# Altium schematic sheet FIT_TCM_Power.SchDoc: FIT_PM12 board
size 420 x 297 mm; CheckedBy: G.Kasprowicz; Author: INR Moscow; CompanyName: WUT ISE; DrawnBy: M.Podgórski; Organization: WUT ISE; Address1: PW ISE; Address2: Nowowiejska 15/19 00-665 Warsaw; Address3: gkasprow@gmail.com; Revision: 2; SheetNumber: -; SheetTotal: -; ModifiedBy: -; CheckedDate: -; Title2: Title 2; DivGrp: WUT ISE; Designer: INR RAS; ModifiedDate: -; ProjectName: Sensor Box
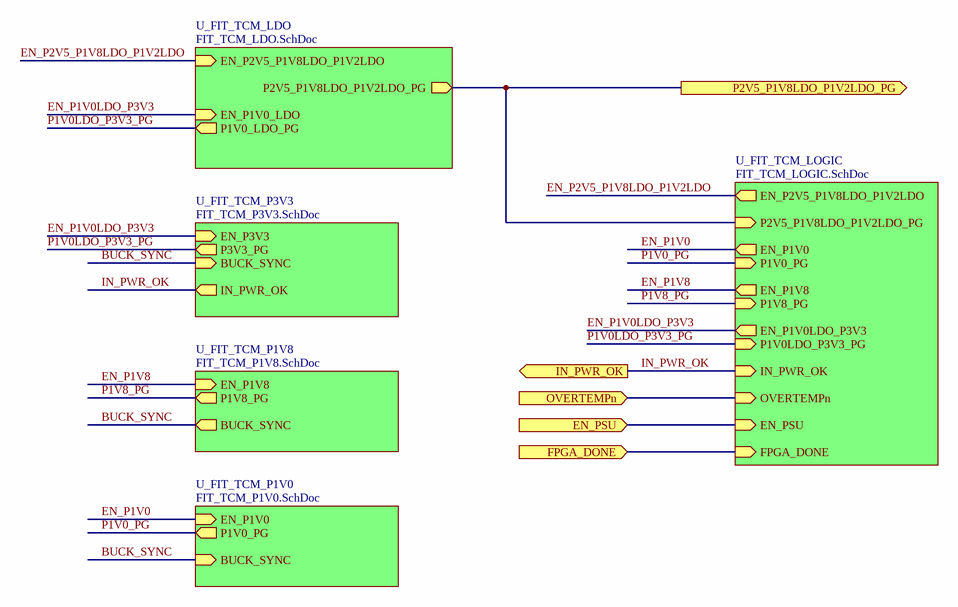
[diagram p0: FIT_TCM_Power.SchDoc]

## Sub-sheets
U_FIT_TCM_LDO = FIT_TCM_LDO.SchDoc: EN_P1V0_LDO (in), P1V0_LDO_PG (out), P2V5_P1V8LDO_P1V2LDO_PG (out), EN_P2V5_P1V8LDO_P1V2LDO (in)
U_FIT_TCM_LOGIC = FIT_TCM_LOGIC.SchDoc: IN_PWR_OK (in), EN_P1V0LDO_P3V3 (out), P1V0LDO_P3V3_PG (in), EN_P1V8 (out), P1V8_PG (in), EN_P1V0 (out), P1V0_PG (in), P2V5_P1V8LDO_P1V2LDO_PG (in), EN_P2V5_P1V8LDO_P1V2LDO (out), EN_PSU (in), OVERTEMPn (in), FPGA_DONE (in)
U_FIT_TCM_P1V0 = FIT_TCM_P1V0.SchDoc: BUCK_SYNC (in), EN_P1V0 (in), P1V0_PG (out)
U_FIT_TCM_P1V8 = FIT_TCM_P1V8.SchDoc: BUCK_SYNC (out), EN_P1V8 (in), P1V8_PG (out)
U_FIT_TCM_P3V3 = FIT_TCM_P3V3.SchDoc: IN_PWR_OK (out), EN_P3V3 (in), BUCK_SYNC (in), P3V3_PG (out)

## Ports
EN_PSU (in), FPGA_DONE (in), IN_PWR_OK (out), OVERTEMPn (in), P2V5_P1V8LDO_P1V2LDO_PG (out)

## Nets
BUCK_SYNC: sheet U_FIT_TCM_P1V0/BUCK_SYNC, sheet U_FIT_TCM_P1V8/BUCK_SYNC, sheet U_FIT_TCM_P3V3/BUCK_SYNC
EN_P1V0: sheet U_FIT_TCM_LOGIC/EN_P1V0, sheet U_FIT_TCM_P1V0/EN_P1V0
EN_P1V0LDO_P3V3: sheet U_FIT_TCM_LDO/EN_P1V0_LDO, sheet U_FIT_TCM_LOGIC/EN_P1V0LDO_P3V3, sheet U_FIT_TCM_P3V3/EN_P3V3
EN_P1V8: sheet U_FIT_TCM_LOGIC/EN_P1V8, sheet U_FIT_TCM_P1V8/EN_P1V8
EN_P2V5_P1V8LDO_P1V2LDO: sheet U_FIT_TCM_LDO/EN_P2V5_P1V8LDO_P1V2LDO, sheet U_FIT_TCM_LOGIC/EN_P2V5_P1V8LDO_P1V2LDO
EN_PSU: port EN_PSU, sheet U_FIT_TCM_LOGIC/EN_PSU
FPGA_DONE: port FPGA_DONE, sheet U_FIT_TCM_LOGIC/FPGA_DONE
IN_PWR_OK: port IN_PWR_OK, sheet U_FIT_TCM_LOGIC/IN_PWR_OK, sheet U_FIT_TCM_P3V3/IN_PWR_OK
OVERTEMPn: port OVERTEMPn, sheet U_FIT_TCM_LOGIC/OVERTEMPn
P1V0_PG: sheet U_FIT_TCM_LOGIC/P1V0_PG, sheet U_FIT_TCM_P1V0/P1V0_PG
P1V0LDO_P3V3_PG: sheet U_FIT_TCM_LDO/P1V0_LDO_PG, sheet U_FIT_TCM_LOGIC/P1V0LDO_P3V3_PG, sheet U_FIT_TCM_P3V3/P3V3_PG
P1V8_PG: sheet U_FIT_TCM_LOGIC/P1V8_PG, sheet U_FIT_TCM_P1V8/P1V8_PG
P2V5_P1V8LDO_P1V2LDO_PG: port P2V5_P1V8LDO_P1V2LDO_PG, sheet U_FIT_TCM_LDO/P2V5_P1V8LDO_P1V2LDO_PG, sheet U_FIT_TCM_LOGIC/P2V5_P1V8LDO_P1V2LDO_PG

## Notes on the sheet
- Project/Equipment
- Document
- Designer
- Drawn by
- Check.by
- Copyright WUT ISE 2024.
  This documentation describes Open Hardware and is licensed under the CERN OHL v.2. You may redistribute and modify this documentation under the terms of the CERN OHL v.2. (http://ohwr.org/CERNOHL). This documentation is distributed WITHOUT ANY EXPRESS OR IMPLIED WARRANTY, INCLUDING OF MERCHANTABILITY, SATISFACTORY QUALITY AND FITNESS FOR A PARTICULAR PURPOSE. Please see the CERN OHL v.2 for applicable conditions.
- Contact
- File
- Last Mod.
- Print Date
- Sheet
- Size
- A3
- of
- Rev